# EAGLE design s3-pilot3 (EAGLE 7.5.0)
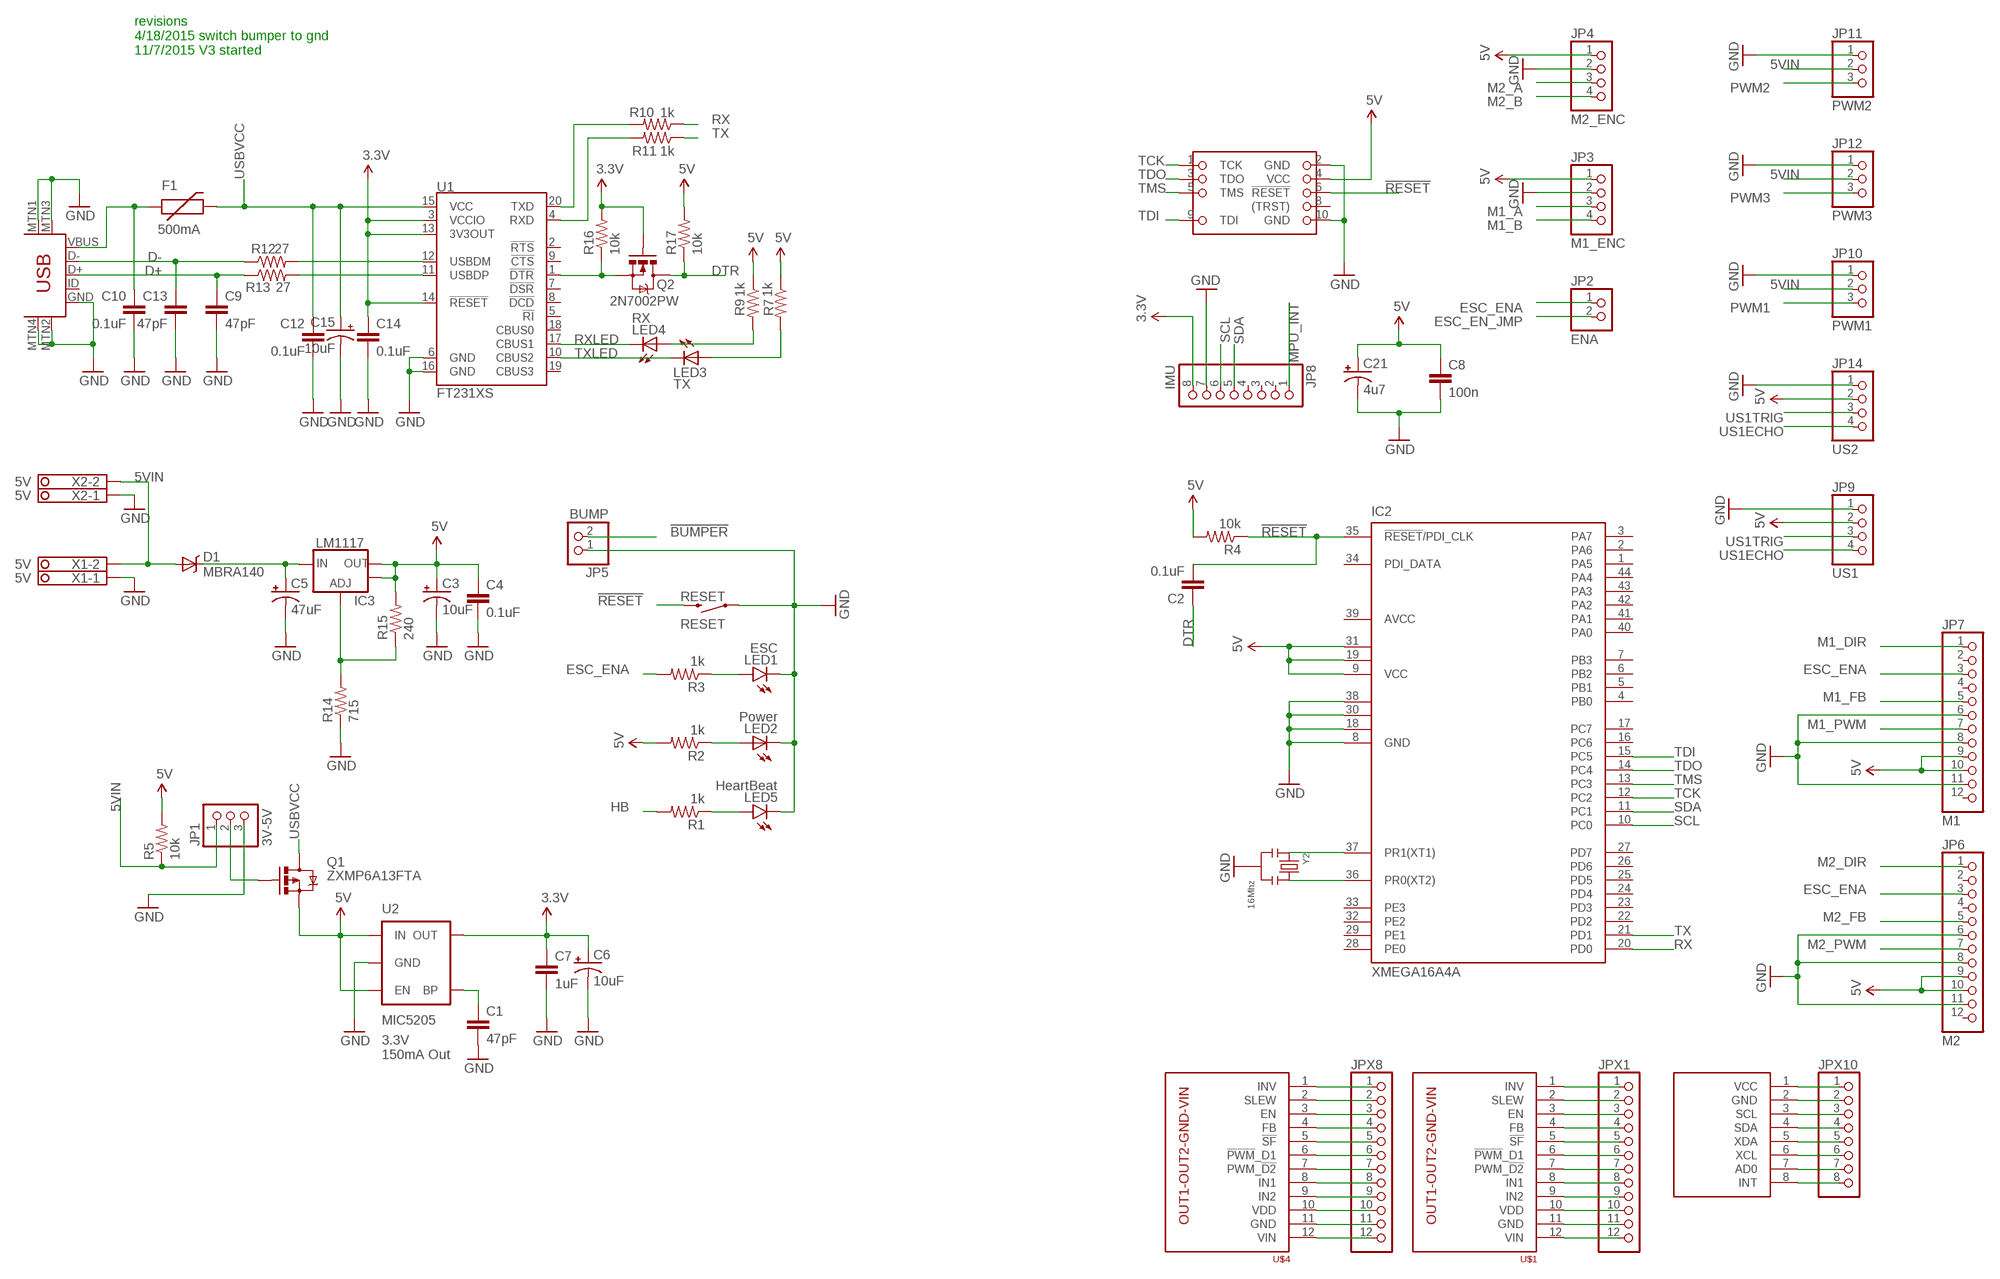
[diagram p0: schematic, sheet 1]

## Parts
C1  47pF  47PF-50V-5%(0603)  [0603-CAP]
C2  0.1uF  CAP0805  [0805]
C3  10uF  CAP_POL1206  [EIA3216]
C4  0.1uF  CAP0603-CAP  [0603-CAP]
C5  47uF  CAP_POLD  [PANASONIC_D]
C6  10uF  CAP_POL1206  [EIA3216]
C7  1uF  CAP0603-CAP  [0603-CAP]
C8  100n  CAP0603-CAP  [0603-CAP]
C9  47pF  47PF-50V-5%(0603)  [0603-CAP]
C10  0.1uF  CAP0603-CAP  [0603-CAP]
C12  0.1uF  CAP0603-CAP  [0603-CAP]
C13  47pF  47PF-50V-5%(0603)  [0603-CAP]
C14  0.1uF  CAP0603-CAP  [0603-CAP]
C15  10uF  CAP_POL1206  [EIA3216]
C21  4u7  CAP_POL1206  [EIA3216]
D1  MBRA140  DIODE-SCHOTTKY_  [SMA-DIODE]
F1  500mA  PTCSMD  [PTC-1206]
IC2  XMEGA16A4A  [TQFP44]
IC3  LM1117  V_REG_LM1117SOT223  [SOT223]
JP1  3V-5V  PINHD-1X3  [1X03]
JP2  ENA  PINHD-1X2  [1X02]
JP3  M1_ENC  PINHD-1X4/90  [1X04/90]
JP4  M2_ENC  PINHD-1X4/90  [1X04/90]
JP5  BUMP  PINHD-1X2/90  [1X02/90]
JP6  M2  PINHD-1X12  [1X12]
JP7  M1  PINHD-1X12  [1X12]
JP8  IMU  PINHD-1X8  [1X08]
JP9  US1  PINHD-1X4/90  [1X04/90]
JP10  PWM1  PINHD-1X3/90  [1X03/90]
JP11  PWM2  PINHD-1X3/90  [1X03/90]
JP12  PWM3  PINHD-1X3/90  [1X03/90]
JP14  US2  PINHD-1X4/90  [1X04/90]
JPX1  PINHD-1X12  [1X12]
JPX8  PINHD-1X12  [1X12]
JPX10  PINHD-1X8  [1X08]
LED1  ESC  LED-RED1206  [LED-1206]
LED2  Power  LED1206  [LED-1206]
LED3  TX  LED1206  [LED-1206]
LED4  RX  LED1206  [LED-1206]
LED5  HeartBeat  LED-RED1206  [LED-1206]
MPU6050  MPU-6050-BO  [MPU-6050-BO]
Q1  ZXMP6A13FTA  MOSFET-PCHANNELSMD  [SOT23-3]
Q2  2N7002PW  MOSFET-NCHANNEL2N7002PW  [SOT323]
R1  1k  RESISTOR0603-RES  [0603-RES]
R2  1k  RESISTOR0603-RES  [0603-RES]
R3  1k  RESISTOR0603-RES  [0603-RES]
R4  10k  RESISTOR0603-RES  [0603-RES]
R5  10k  RESISTOR0603-RES  [0603-RES]
R7  1k  RESISTOR0603-RES  [0603-RES]
R9  1k  RESISTOR0603-RES  [0603-RES]
R10  1k  RESISTOR0603-RES  [0603-RES]
R11  1k  RESISTOR0603-RES  [0603-RES]
R12  27  RESISTOR0603-RES  [0603-RES]
R13  27  RESISTOR0603-RES  [0603-RES]
R14  715  RESISTOR0603-RES  [0603-RES]
R15  240  RESISTOR0603-RES  [0603-RES]
R16  10k  RESISTOR0603-RES  [0603-RES]
R17  10k  RESISTOR0603-RES  [0603-RES]
RESET  RESET  SWITCH-MOMENTARY-2SMD-4  [TACTILE_SWITCH_TALL]
U1  FT231XS  [SSOP20_L]
U2  MIC5205  V_REG_LDOSMD  [SOT23-5]
U$1  M2  MC33926-SINGLE-BO  [MC33926-SINGLE-BO]
U$2  JTAG  CON-JTAG  [2X5/05]
U$4  M2  MC33926-SINGLE-BO  [MC33926-SINGLE-BO]
U$13  USB-MINIB-5PIN  [USB-MINIB]
X1  5V  1751248  [1751248]
X2  5V  1751248  [1751248]
Y2  16Mhz  SMD-RESONATOR-KYOCERA-PBRV-H  [SMD-KYOCERA-PBRV-H]

## Nets
3.3V: C6.A(+) C7.1 C14.1 JP8.8 Q2.1(G) R16.2 U1.3(VCCIO) U1.13(3V3OUT) U1.14(!RESET) U2.5(OUT)
5V [power]: C3.A(+) C4.1 C8.1 C21.A(+) IC2.9(VCC) IC2.19(VCC1) IC2.31(VCC2) IC3.2(OUT) IC3.4(OUT) JP3.1 JP4.1 JP6.9 JP6.10 JP7.9 JP7.10 JP9.2 JP14.2 Q1.2(S) R2.2 R4.2 R5.2 R7.1 R9.1 R15.2 R17.2 U2.1(IN) U2.3(EN) U$2.4(VCC)
5VIN [power]: D1.A JP1.1 JP10.2 JP11.2 JP12.2 R5.1 X1.2 X2.2
!BUMPER: JP5.2
!RESET: C2.2 IC2.35(!RESET!/PDI_CLK) R4.1 RESET.B2 U$2.6(!RESET)
D+: C9.1 R13.1 U$13.D+
D-: C13.1 R12.1 U$13.D-
DTR: C2.1 Q2.3(D) R17.1
ESC_EN_JMP: JP2.2
ESC_ENA: JP2.1 JP6.3 JP7.3 R3.2
GND [power]: C1.2 C3.C(-) C4.2 C5.- C6.C(-) C7.2 C8.2 C9.2 C10.2 C12.2 C13.2 C14.2 C15.C(-) C21.C(-) IC2.8(GND) IC2.18(GND1) IC2.30(GND2) IC2.38(GND3) JP1.3 JP3.2 JP4.2 JP5.1 JP6.6 JP6.8 JP6.11 JP7.6 JP7.8 JP7.11 JP8.7 JP9.1 JP10.1 JP11.1 JP12.1 JP14.1 LED1.C LED2.C LED5.C R14.1 RESET.A2 U1.6(GND) U1.16(GND) U2.2(GND) U$2.2(GND) U$2.10(GND) U$13.GND U$13.MTN1(MTN2) U$13.MTN2(MTN3) U$13.MTN3(MTN1) U$13.MTN4 X1.1 X2.1 Y2.2
HB: R1.2
M1_A: JP3.3
M1_B: JP3.4
M1_DIR: JP7.1
M1_FB: JP7.5
M1_PWM: JP7.7
M2_A: JP4.3
M2_B: JP4.4
M2_DIR: JP6.1
M2_FB: JP6.5
M2_PWM: JP6.7
MPU_INT: JP8.1
N$1: JPX8.1 U$4.1(INV)
N$2: LED2.A R2.1
N$3: JPX8.2 U$4.2(SLEW)
N$4: JPX8.3 U$4.3(EN)
N$6: R12.2 U1.12(USBDM)
N$7: R13.2 U1.11(USBDP)
N$8: LED3.A R7.2
N$10: LED4.A R9.2
N$11: C1.1 U2.4(BP)
N$12: Q2.2(S) R16.1 U1.1(!DTR)
N$13: JPX10.1 MPU6050.1(VCC)
N$14: JPX10.2 MPU6050.2(GND)
N$15: IC3.1(ADJ) R14.2 R15.1
N$16: JPX10.3 MPU6050.3(SCL)
N$17: JPX10.4 MPU6050.4(SDA)
N$18: JPX1.1 U$1.1(INV)
N$19: JPX10.5 MPU6050.5(XDA)
N$20: JPX10.6 MPU6050.6(XCL)
N$21: LED5.A R1.1
N$22: JPX10.7 MPU6050.7(AD0)
N$23: LED1.A R3.1
N$24: JP1.2 Q1.1(G)
N$25: JPX1.2 U$1.2(SLEW)
N$26: JPX10.8 MPU6050.8(INT)
N$27: JPX8.4 U$4.4(FB)
N$28: JPX8.5 U$4.5(!SF)
N$29: JPX8.6 U$4.6(!PWM!_D1)
N$30: JPX8.7 U$4.7(PWM_!D2)
N$31: JPX8.8 U$4.8(IN1)
N$32: JPX8.9 U$4.9(IN2)
N$33: JPX8.10 U$4.10(VDD)
N$34: JPX8.11 U$4.11(GND)
N$35: JPX8.12 U$4.12(VIN)
N$36: IC2.36(PR0(XT2)) Y2.3
N$37: JPX1.3 U$1.3(EN)
N$38: JPX1.4 U$1.4(FB)
N$39: JPX1.5 U$1.5(!SF)
N$40: IC2.37(PR1(XT1)) Y2.1
N$41: JPX1.6 U$1.6(!PWM!_D1)
N$42: JPX1.7 U$1.7(PWM_!D2)
N$43: JPX1.8 U$1.8(IN1)
N$44: JPX1.9 U$1.9(IN2)
N$45: JPX1.10 U$1.10(VDD)
N$46: JPX1.11 U$1.11(GND)
N$47: JPX1.12 U$1.12(VIN)
PISUPPLY: C5.+ D1.C IC3.3(IN)
PWM1: JP10.3
PWM2: JP11.3
PWM3: JP12.3
RX: IC2.20(PD0) R10.1
RXD: R11.2 U1.4(RXD)
RXLED: LED4.C U1.17(CBUS1)
SCL: IC2.10(PC0) JP8.6
SDA: IC2.11(PC1) JP8.5
TCK: IC2.12(PC2) U$2.1(TCK)
TDI: IC2.15(PC5) U$2.9(TDI)
TDO: IC2.14(PC4) U$2.3(TDO)
TMS: IC2.13(PC3) U$2.5(TMS)
TX: IC2.21(PD1) R11.1
TXD: R10.2 U1.20(TXD)
TXLED: LED3.C U1.10(CBUS2)
US1ECHO: JP9.4 JP14.4
US1TRIG: JP9.3 JP14.3
USBVCC [power]: C12.1 C15.A(+) F1.2 Q1.3(D) U1.15(VCC)
VUSB [power]: C10.1 F1.1 U$13.VBUS
Unconnected: IC2.1(PA5) IC2.2(PA6) IC2.3(PA7) IC2.4(PB0) IC2.5(PB1) IC2.6(PB2) IC2.7(PB3) IC2.16(PC6) IC2.17(PC7) IC2.22(PD2) IC2.23(PD3) IC2.24(PD4) IC2.25(PD5) IC2.26(PD6) IC2.27(PD7) IC2.28(PE0) IC2.29(PE1) IC2.32(PE2) IC2.33(PE3) IC2.34(PDI_DATA) IC2.40(PA0) IC2.41(PA1) IC2.42(PA2) IC2.43(PA3) IC2.44(PA4) JP6.2 JP6.4 JP6.12 JP7.2 JP7.4 JP7.12 JP8.2 JP8.3 JP8.4 U1.2(!RTS) U1.5(!RI) U1.7(!DSR) U1.8(!DCD) U1.9(!CTS) U1.18(CBUS0) U1.19(CBUS3) U$2.8((TRST)) U$13.ID

## Notes on the sheet
- revisions
  4/18/2015 switch bumper to gnd
  11/7/2015 V3 started
- 3.3V
  150mA Out

## Power pins joined to a net without a drawn wire
AVCC: IC2.39(AVCC)

## Library data of the parts
C1 C9 C13 = SparkFun-Capacitors:47PF-50V-5%(0603): CAP-08913; PROD_ID: CAP-08913
C2 C4 C7 C8 C10 C12 C14 = SparkFun:CAP: Capacitor Standard 0603 ceramic capacitor, and 0.1" leaded capacitor.
C3 C5 C6 C21 = SparkFun:CAP_POL: Capacitor Polarized These are standard SMD and PTH capacitors. Normally 10uF, 47uF, and 100uF in electrolytic and tantalum varieties. Always verify the external diameter of the through hole cap, it varies with capacity, voltage, and manufacturer. The EIA devices should be standard.
C15 = SparkFun-Capacitors:CAP_POL: Capacitor Polarized These are standard SMD and PTH capacitors. Normally 10uF, 47uF, and 100uF in electrolytic and tantalum varieties. Always verify the external diameter of the through hole cap, it varies with capacity, voltage, and manufacturer. The EIA devices should be standard.
D1 = SparkFun:DIODE-SCHOTTKY
F1 = SparkFun:PTC: Resettable Fuse PTC Resettable Fuse. Spark Fun Electronics SKU : COM-08357
IC2 = atmel:XMEGA16A4: MICROCONTROLLER Features High-performance, Low-power 8/16-bit AVR XMEGA Microcontroller Non-Volatile Program and Data Memories - 16 KB - 128 KB of In-System Self-Programmable Flash - 4 KB - 8 KB Boot Code Section with Independent Lock Bits - 1 KB - 2 KB EEPROM - 2 KB - 8 KB Internal SRAM Peripheral Features - Four-channel DMA Controller with support for external requests - Eight-channel Event System - Five 16-bit Timer/Counters Three Timer/Counters with 4 Output Compare or Input Capture channels Two Timer/Counters with 2 Output Compare or Input Capture channels High-Resolution Extensions on all Timer/Counters Advanced Waveform Extension on one Timer/Counter - Five USARTs IrDA Extension on one USART - Two Two-Wire Interfaces with dual address match (I2C and SMBus compatible) - Two SPIs (Serial Peripheral Interfaces) peripherals - AES and DES Crypto Engine - 16-bit Real Time Counter with Separate Oscillator - One Twelve-channel, 12-bit, 2 Msps Analog to Digital Converter - One Two-channel, 12-bit, 1 Msps Digital to Analog Converter - Two Analog Comparators with Window compare function - External Interrupts on all General Purpose I/O pins - Programmable Watchdog Timer with Separate On-chip Ultra Low Power Oscillator Special Microcontroller Features - Power-on Reset and Programmable Brown-out Detection - Internal and External Clock Options with PLL - Programmable Multi-level Interrupt Controller - Sleep Modes: Idle, Power-down, Standby, Power-save, Extended Standby - Advanced Programming, Test and Debugging Interfaces PDI (Program and Debug Interface) for programming, test and debugging I/O and Packages - 34 Programmable I/O Lines - 44 - lead TQFP - 44 - pad VQFN/QFN - 49 - ball VFBGA Operating Voltage - 1.6 - 3.6V Speed performance - 0 - 12 MHz @ 1.6 - 3.6V - 0 - 32 MHz @ 2.7 - 3.6V Drawn by Dipl.-Ing. (FH) Robert Siegler Created: 27.05.09; OC_FARNELL: unknown; OC_NEWARK: unknown
IC3 = Testing:V_REG_LM1117: Voltage Regulator LM1117 Standard adjustable voltage regulator but in SMD form. Spark Fun Electronics SKU : COM-00595
JP1 JP10-JP12 = pinhead:PINHD-1X3: PIN HEADER
JP2 JP5 = pinhead:PINHD-1X2: PIN HEADER
JP3 JP4 JP9 JP14 = pinhead:PINHD-1X4: PIN HEADER
JP6 JP7 JPX1 JPX8 = pinhead:PINHD-1X12: PIN HEADER
JP8 JPX10 = pinhead:PINHD-1X8: PIN HEADER
LED1 LED5 = SparkFun-LED:LED-RED: Assorted Red LEDs LilyPad 1206- DIO-09912 1206- DIO-00809 0603- DIO-00819; PROD_ID: DIO-00809; VALUE: RED
LED2-LED4 = SparkFun-LED:LED: LEDs Standard schematic elements and footprints for 5mm, 3mm, 1206, and 0603 sized LEDs. 5mm - Spark Fun Electronics SKU : COM-00529 (and others)
MPU6050 = s3-pilot2-lbr:MPU-6050-BO
Q1 = SparkFun:MOSFET-PCHANNEL
Q2 = SparkFun-DiscreteSemi:MOSFET-NCHANNEL: Common NMOSFET Parts MFG P/N Store ID Prod ID FDD8780 TRANS-09984 SI7820DN TRANS-11055 FDS6630A IC-08089 2N7002PW TRANS-11151 FQP30N06L COM-10213 TRANS-10060 BSS123LT1G TRANS-08345 BSS138 TRANS-00830 BS170 2N7000; PROD_ID: TRANS-11151
R1-R5 R7 R9-R11 R14-R17 = SparkFun:RESISTOR: Resistor Basic schematic elements and footprints for 0603, 1206, and PTH resistors.
R12 R13 = SparkFun-Resistors:RESISTOR: Resistor Basic schematic elements and footprints for 0603, 1206, and PTH resistors.
RESET = SparkFun-Electromechanical:SWITCH-MOMENTARY-2: Various NO switches- pushbuttons, reed, etc; PROD_ID: SWCH-11966
U1 = SparkFun-DigitalIC:FT231X: FTDI FT231X Full Speed USB to Full-handshake UART This USB2.0 Full Speed IC offers a compact bridge to full handshake UART interfaces. The device is a UART, capable of operating up to 3MBaud, with low power consumption (8mA). The FT231X includes the complete FT-X series feature set and enables USB to be added into a system design quickly and easily over a UART interface.
U2 = SparkFun:V_REG_LDO: Voltage Regulator LDO Standard 150mA LDO voltage regulator in SOT-23 layout. Micrel part MIC5205. BP (by-pass) pin is used to lower output noise with 470pF cap.
U$1 U$4 = s3-pilot2-lbr:MC33926-SINGLE-BO
U$2 = s3-pilot2-lbr:CON-JTAG
U$13 = SparkFun-Connectors:USB-MINIB: Mini-USB "B" connector with 5th pin broken out. Created new symbol breaking out 5th "ID" pin in mini/micro USB connector spec. See: http://en.wikipedia.org/wiki/Mini_usb#Cables. Uses same footprint as 4-pin symbol. Also added pins to connect to mounting / shield pads if required (probably not generally needed as signals aren't shielded once they leave the connector).
X1 X2 = con-phoenix-350:1751248: MKDS 1/ 2-3,5 Printklemme Nennstrom: 10 A Bemessungsspannung: 160 V Raster: 3,5 mm Polzahl: 2 Montageart: Löten Anschlussart: Schraubanschluss Anschlussrichtung vom Leiter zur Platine: 0° Source: http://eshop.phoenixcontact.com .. 1751248.pdf; OC_FARNELL: unknown; OC_NEWARK: unknown
Y2 = s3-pilot2-lbr:SMD-RESONATOR-KYOCERA-PBRV-H: kyocera PBRC14.74HR50X000; OPTION: Crystal or ceramic resonator. Max 12MHz for 3V3 operation.

## Net classes
1 power: width 0.381 mm

## Board
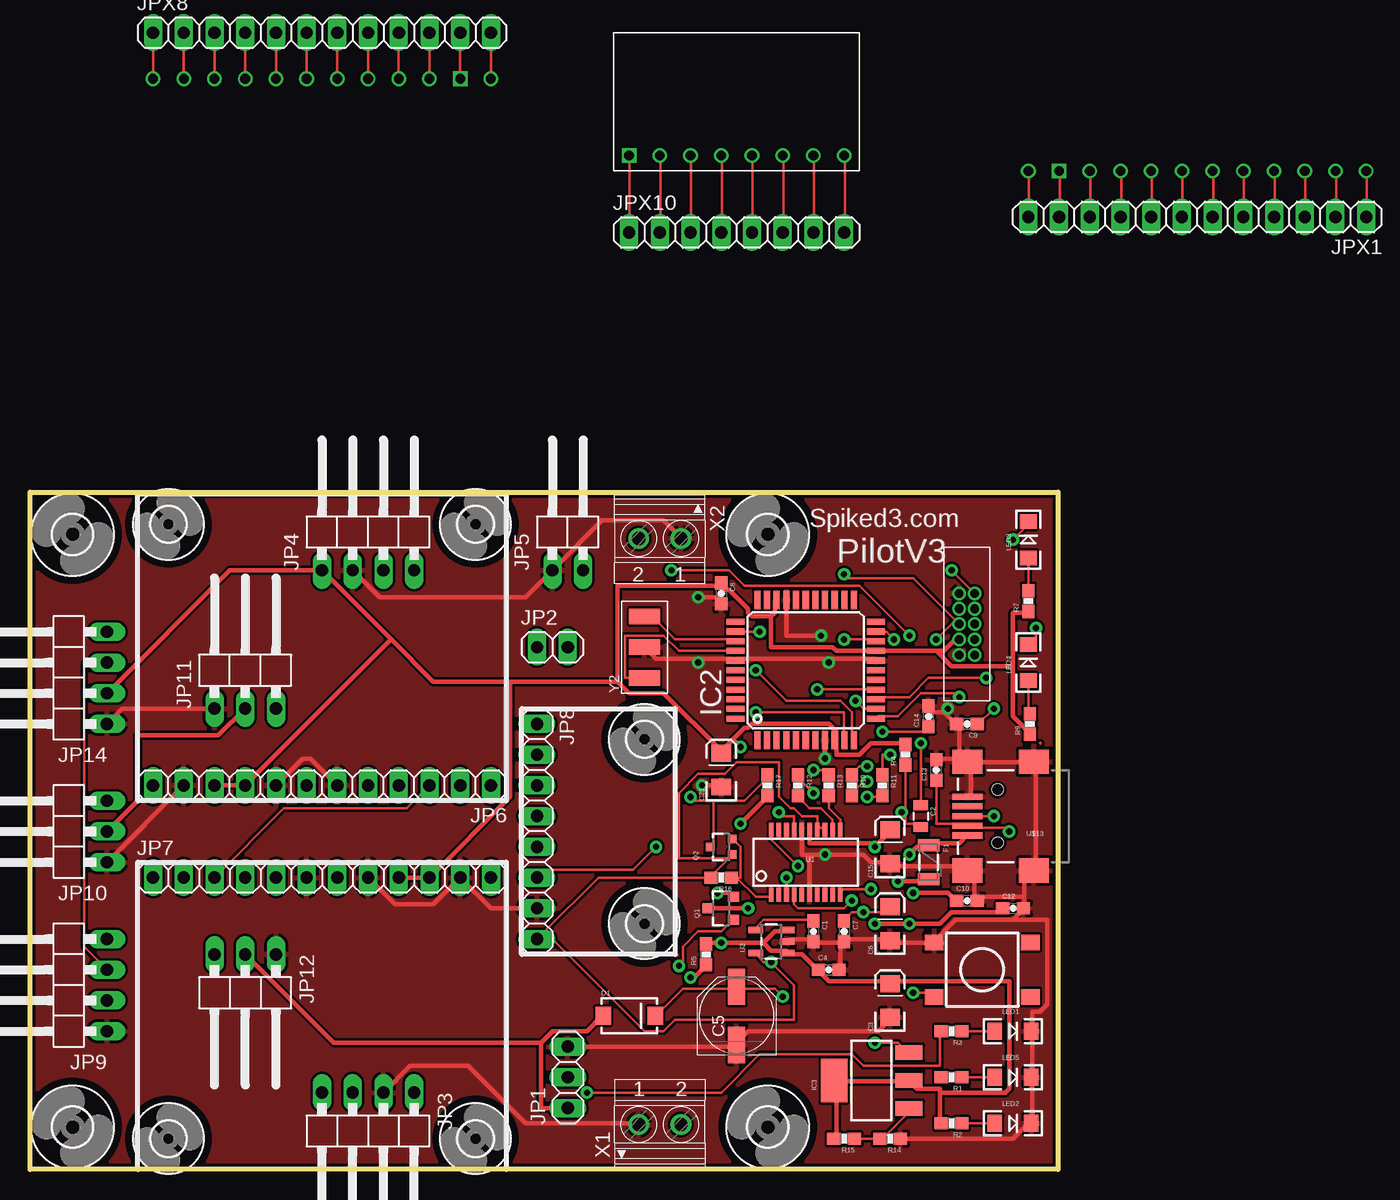
[diagram p1: board, top side]
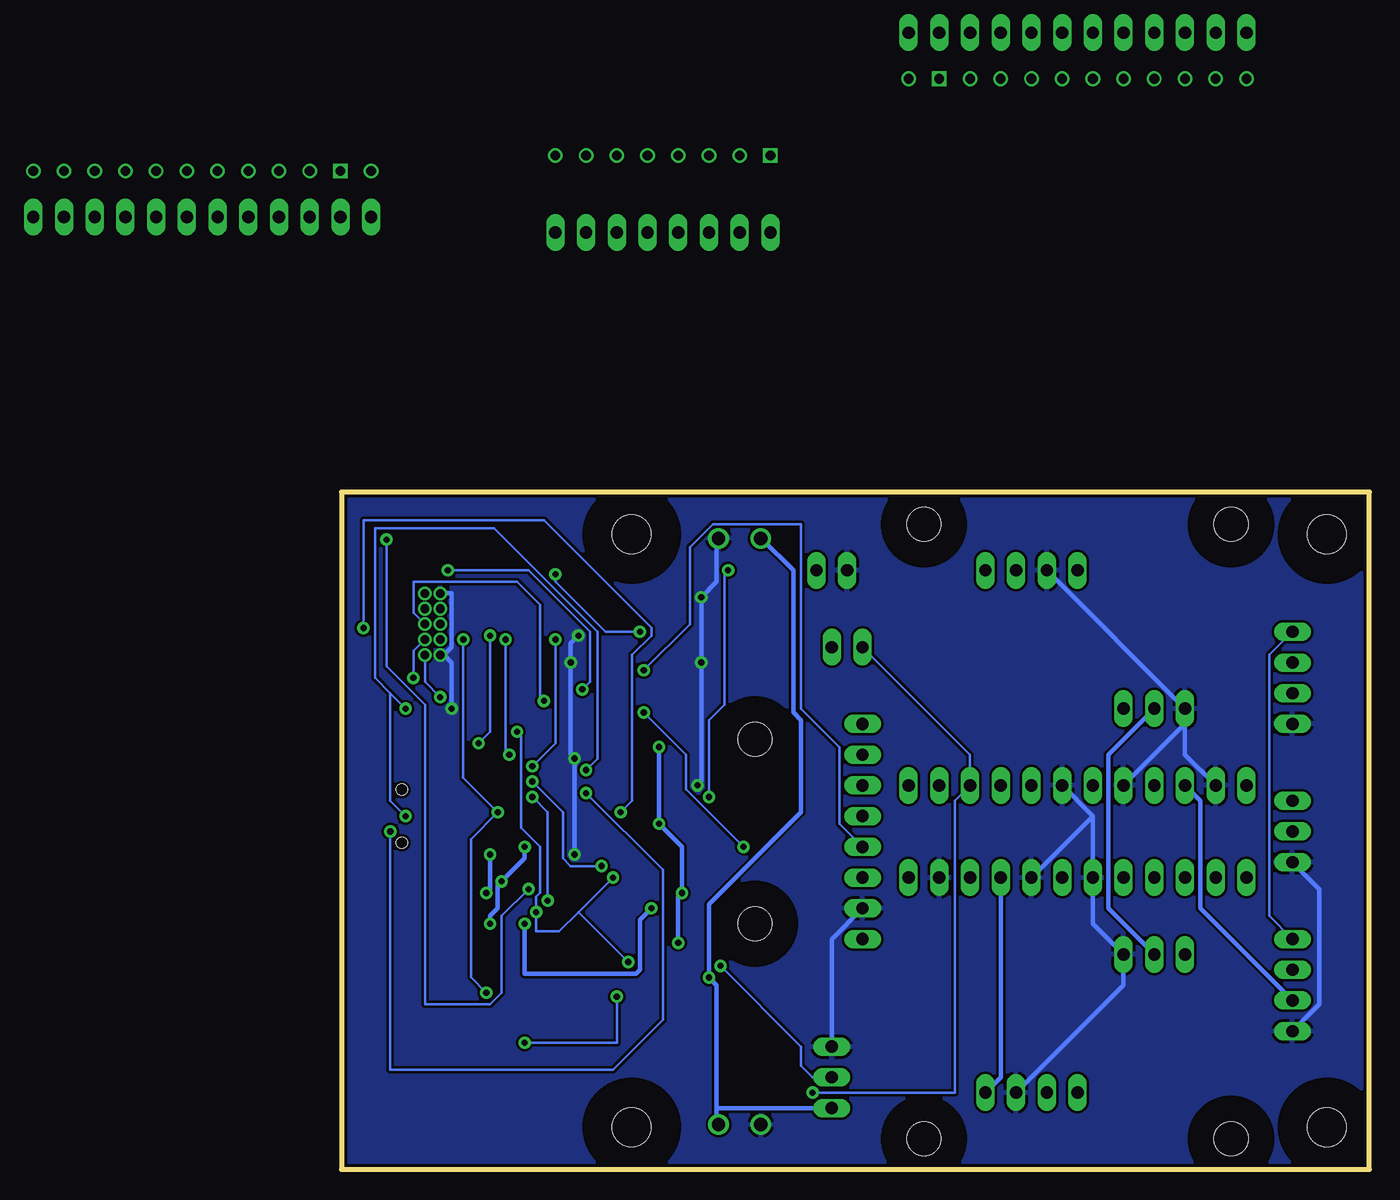
[diagram p2: board, bottom side, seen from below]

Size 85 x 56 mm. Coordinates in mm from the lower left corner, seen from the top.
Outline: 85,0 0,0 0,56 85,56 85,0
Copper layers (1*16): Top 0.035mm / dielectric 1.5mm / Bottom 0.035mm
Design rules "SparkFun *": minimum track width 8mil, minimum drill 20mil, track to track 8mil, track to pad 8mil, pad to pad 8mil, via to via 8mil, smd to smd 8mil, copper to edge 10mil, drill to drill 8mil, minimum pad ring 8mil, minimum via ring 10mil, stop-mask expansion 4mil, vias tented up to drill 25mil, thermal gap 10mil

### Footprints (pad centres in the part's own frame; a part is rotated, then mirrored left to right if it is on the bottom)
0603-CAP = smd 1.1 x 1: 1 -0.85,0; 2 0.85,0
0805 = smd 0.8 x 1.2: 1 -0.9,0; 2 0.9,0
EIA3216 = smd 1.4 x 1.6: A 1.4,0; C -1.4,0
PANASONIC_D = smd 3 x 1.4: + 2.4,0; - -2.4,0
SMA-DIODE = smd 1.27 x 1.47: A -2.15,0; C 2.15,0
2,8 = hole 2.8: 0,0
3,2 = hole 3.2: 0,0
PTC-1206 = smd 1 x 1.8: 1 -1.4,0; 2 1.4,0
TQFP44 = smd 1.5 x 0.5: 1 -5.8,4; 2 -5.8,3.2; 3 -5.8,2.4; 4 -5.8,1.6; 5 -5.8,0.8; 6 -5.8,0; 7 -5.8,-0.8; 8 -5.8,-1.6; 9 -5.8,-2.4; 10 -5.8,-3.2; 11 -5.8,-4; 23 5.8,-4; 24 5.8,-3.2; 25 5.8,-2.4; 26 5.8,-1.6; 27 5.8,-0.8; 28 5.8,0; 29 5.8,0.8; 30 5.8,1.6; 31 5.8,2.4; 32 5.8,3.2; 33 5.8,4 | smd 0.5 x 1.5: 12 -4,-5.8; 13 -3.2,-5.8; 14 -2.4,-5.8; 15 -1.6,-5.8; 16 -0.8,-5.8; 17 0,-5.8; 18 0.8,-5.8; 19 1.6,-5.8; 20 2.4,-5.8; 21 3.2,-5.8; 22 4,-5.8; 34 4,5.8; 35 3.2,5.8; 36 2.4,5.8; 37 1.6,5.8; 38 0.8,5.8; 39 0,5.8; 40 -0.8,5.8; 41 -1.6,5.8; 42 -2.4,5.8; 43 -3.2,5.8; 44 -4,5.8
SOT223 = smd 1.219 x 2.235: 1 -2.311,-3.099; 2 0,-3.099; 3 2.311,-3.099 | smd 3.6 x 2.2: 4 0,3.099
1X03 = drill 1.016 long: 1 -2.54,0; 2 0,0; 3 2.54,0
1X02 = drill 1.016 long: 1 -1.27,0; 2 1.27,0
1X04/90 = drill 1.016 long: 1 -3.81,-3.81; 2 -1.27,-3.81; 3 1.27,-3.81; 4 3.81,-3.81
1X02/90 = drill 1.016 long: 1 -1.27,-3.81; 2 1.27,-3.81
1X12 = drill 1.016 long: 1 -13.97,0; 2 -11.43,0; 3 -8.89,0; 4 -6.35,0; 5 -3.81,0; 6 -1.27,0; 7 1.27,0; 8 3.81,0; 9 6.35,0; 10 8.89,0; 11 11.43,0; 12 13.97,0
1X08 = drill 1.016 long: 1 -8.89,0; 2 -6.35,0; 3 -3.81,0; 4 -1.27,0; 5 1.27,0; 6 3.81,0; 7 6.35,0; 8 8.89,0
1X03/90 = drill 1.016 long: 1 -2.54,-3.81; 2 0,-3.81; 3 2.54,-3.81
LED-1206 = smd 1.2 x 1.4: A -1.5,0; C 1.5,0
MPU-6050-BO = drill 0.8 square: 1 1.27,19.05 | drill 0.8: 2 1.27,16.51; 3 1.27,13.97; 4 1.27,11.43; 5 1.27,8.89; 6 1.27,6.35; 7 1.27,3.81; 8 1.27,1.27
SOT23-3 = smd 0.8 x 0.9: 1 -0.95,-1; 2 0.95,-1; 3 0,1.1
SOT323 = smd 0.7 x 0.7: 1 -0.65,-0.925; 2 0.65,-0.925; 3 0,0.925
0603-RES = smd 1.1 x 1: 1 -0.85,0; 2 0.85,0
TACTILE_SWITCH_TALL = smd 1.55 x 1.3: A1 -3.975,-2.25; A2 3.975,-2.25; B1 -3.975,2.25; B2 3.975,2.25
SSOP20_L = smd 0.381 x 1.143: 1 -2.857,-2.68; 2 -2.223,-2.68; 3 -1.587,-2.68; 4 -0.953,-2.68; 5 -0.318,-2.68; 6 0.318,-2.68; 7 0.953,-2.68; 8 1.587,-2.68; 9 2.223,-2.68; 10 2.857,-2.68; 11 2.857,2.68; 12 2.223,2.68; 13 1.587,2.68; 14 0.953,2.68; 15 0.318,2.68; 16 -0.318,2.68; 17 -0.953,2.68; 18 -1.587,2.68; 19 -2.223,2.68; 20 -2.857,2.68
SOT23-5 = smd 0.55 x 1.2: 1 -0.95,-1.3; 2 0,-1.3; 3 0.95,-1.3; 4 0.95,1.3; 5 -0.95,1.3
MC33926-SINGLE-BO = drill 0.8: 1 -5.08,-21.59; 2 -5.08,-19.05; 3 -5.08,-16.51; 4 -5.08,-13.97; 5 -5.08,-11.43; 6 -5.08,-8.89; 7 -5.08,-6.35; 8 -5.08,-3.81; 9 -5.08,-1.27; 10 -5.08,1.27; 12 -5.08,6.35 | drill 0.8 square: 11 -5.08,3.81
2X5/05 = drill 0.711: 1 -0.635,3.175; 2 0.635,3.175; 3 -0.635,1.905; 4 0.635,1.905; 5 -0.635,0.635; 6 0.635,0.635; 7 -0.635,-0.635; 8 0.635,-0.635 | drill 0.7: 9 -0.635,-1.905; 10 0.635,-1.905
USB-MINIB = smd 2.5 x 0.5: D+ 2.5,0; D- 2.5,0.8; GND 2.5,-1.6; ID 2.5,-0.8; VBUS 2.5,1.6 | smd 2.5 x 2: MTN1 -3,4.5; MTN2 2.5,4.5; MTN3 -3,-4.5; MTN4 2.5,-4.5 | hole 0.9: 0,2.2; 0,-2.2
1751248 = drill 1.1 pad 1.7: 1 -1.75,-0.1; 2 1.75,-0.1
SMD-KYOCERA-PBRV-H = smd 1.27 x 2.54: 1 -2.54,0; 2 0,0; 3 2.54,0

### Placement (x,y rotation side)
C1  64.77,19.68 270 top
C2  73.66,29.21 270 top
C3  71.12,13.97 90 top
C4  66.04,16.51 0 top
C5  58.42,12.7 90 top
C6  71.12,20.32 90 top
C7  67.31,19.68 270 top
C8  57.15,47.62 270 top
C9  77.47,36.83 180 top
C10  77.47,22.23 0 top
C12  81.28,21.59 0 top
C13  74.93,33.02 90 top
C14  74.3,37.47 90 top
C15  71.12,26.67 90 top
C21  57.15,33.02 90 top
D1  49.53,12.7 0 top
E$1  [2,8]  50.8,20.32 0 top
E$2  [3,2]  3.5,3.5 90 top
E$3  [3,2]  3.5,52.5 90 top
E$4  [2,8]  50.8,35.56 0 top
E$5  [3,2]  61,3.5 90 top
E$6  [3,2]  61,52.5 90 top
E$12  [2,8]  11.43,53.34 0 top
E$15  [2,8]  36.83,53.34 0 top
E$16  [2,8]  11.43,2.54 0 top
E$17  [2,8]  36.83,2.54 0 top
F1  74.3,25.4 270 top
IC2  64.14,41.27 90 top
IC3  69.58,7.35 90 top
JP1  44.45,7.62 90 top
JP2  43.18,43.18 0 top
JP3  27.94,2.54 180 top
JP4  27.94,53.34 0 top
JP5  44.45,53.34 0 top
JP6  24.13,31.75 180 top
JP7  24.13,24.13 0 top
JP8  41.91,27.94 270 top
JP9  2.54,15.24 90 top
JP10  2.54,27.94 90 top
JP11  17.78,41.91 0 top
JP12  17.78,13.97 180 top
JP14  2.54,40.64 90 top
JPX1  96.52,78.74 180 top  (outside the outline)
JPX8  24.13,93.98 0 top  (outside the outline)
JPX10  58.42,77.47 0 top  (outside the outline)
LED1  81.28,11.43 0 top
LED2  81.28,3.81 0 top
LED3  82.55,52.07 90 top
LED4  82.55,41.91 90 top
LED5  81.28,7.62 0 top
MPU6050  68.58,82.55 90 top  (outside the outline)
Q1  57.15,21.59 90 top
Q2  57.15,26.67 90 top
R1  76.2,7.62 180 top
R2  76.2,3.81 180 top
R3  76.2,11.43 180 top
R4  72.39,34.29 90 top
R5  55.88,17.78 90 top
R7  82.55,46.99 90 top
R9  82.68,36.83 90 top
R10  67.94,31.75 270 top
R11  70.48,31.75 270 top
R12  63.5,31.75 270 top
R13  66.04,31.75 270 top
R14  71.12,2.54 180 top
R15  67.31,2.54 180 top
R16  57.15,24.13 180 top
R17  60.96,31.75 270 top
RESET  78.74,16.51 180 top
U1  64.14,25.4 0 top
U2  61.3,18.84 90 top
U$1  88.9,87.63 90 top  (outside the outline)
U$2  77.47,45.72 180 top
U$4  31.75,85.09 270 top  (outside the outline)
U$13  80.01,29.21 180 top
X1  52.07,3.81 0 top
X2  52.07,52.07 180 top
Y2  50.8,43.18 90 top

### Tracks (layer width: path | path; a pad name or v marks a point on that pad's centre or on a via)
3.3V  (via drill 0.51)
  Top 0.203: C7.1 67.31,20.64 67.94,21.27 v68.9,21.27 70.8,21.27 71.12,21.59 C6.A | v70.48,36.2 73.98,36.2 74.3,36.51 C14.1 | v62.55,24.13 U1.3 | U2.5 60.01,17.78 60.64,17.14 v61.28,17.14 63.18,15.24 63.18,12.38 53.34,12.38 52.39,11.43 50.8,11.43 42.55,19.68 | 65.09,28.26 65.72,28.26 U1.13 | 56.2,24.13 57.78,25.72 | 65.09,28.26 65.09,29.21 63.82,29.21 63.18,29.84 62.87,29.84 61.91,30.8 61.91,33.66 58.42,33.66 57.47,32.7 55.24,32.7 53.66,31.11 53.66,25.72 57.78,25.72 | 65.09,28.26 U1.14 | 57.78,25.72 Q2.1 | 42.55,19.68 46.99,24.13 56.2,24.13 | 56.2,24.13 R16.2 | 42.55,19.68 JP8.8
  Bottom 0.203: v70.48,36.2 70.17,35.88 70.17,28.26 68.58,26.67 68.58,22.86 68.9,22.54 v68.9,21.27 68.9,19.68 66.99,19.68 65.41,21.27 | 65.41,21.27 v62.55,24.13 | 65.41,21.27 v61.28,17.14
5V  (via drill 0.51)
  Top 0.381: 75.25,6.35 75.25,6.67 73.34,6.67 72.71,7.3 IC3.2 72.39,7.3 66.67,7.3 | 75.25,6.35 75.25,3.81 R2.2 | 66.67,7.3 66.67,2.54 R15.2 | 66.67,7.3 IC3.4 | 65.09,16.51 63.82,17.78 62.87,17.78 U2.1 62.55,18.1 61.28,18.1 60.64,18.73 | 71.12,15.56 66.04,15.56 65.09,16.51 | 65.09,16.51 C4.1 | v56.83,22.86 57.78,22.86 58.1,22.54 Q1.2 | R5.2 55.88,18.73 v57.15,18.73 60.64,18.73 | v58.74,28.57 60.96,30.8 R17.2 | 60.64,18.73 61.59,19.68 62.55,19.68 U2.3 | 75.25,6.35 80.64,6.35 80.96,6.67 80.96,15.56 71.12,15.56 | 71.12,15.56 C3.A | JP6.10 JP6.9 29.84,43.81 | JP14.2 16.51,49.53 JP4.1 29.84,43.81 | JP7.9 JP7.10 39.69,30.8 39.69,40.32 | R4.2 72.39,35.24 69.53,35.24 68.58,34.29 66.67,34.29 66.67,35.24 IC2.9 66.67,35.56 66.67,36.2 66.04,36.83 59.69,36.83 59.37,36.51 59.05,36.51 58.1,35.56 | 58.1,35.56 57.15,34.61 | 81.28,41.59 81.28,46.04 82.55,46.04 R7.1 | 81.28,41.59 81.28,37.47 82.55,36.2 R9.1 | 57.15,48.26 57.47,47.94 57.78,47.94 59.37,46.35 59.37,46.04 59.69,45.72 61.28,45.72 | 61.28,45.72 61.59,46.04 61.59,46.99 IC2.31 | 74.93,42.86 75.56,42.86 76.52,43.81 U$2.4 | 74.93,42.86 70.17,42.86 IC2.19 69.85,42.86 66.67,42.86 66.36,43.18 61.28,43.18 61.28,45.72 | 81.28,41.59 76.2,41.59 74.93,42.86 | 57.15,34.61 52.39,39.37 49.53,39.37 48.58,40.32 | 48.58,40.32 48.58,48.26 57.15,48.26 | 57.15,34.61 C21.A | 57.15,48.26 C8.1 | 48.58,40.32 39.69,40.32 | 29.84,43.81 33.34,40.32 39.69,40.32 | 58.1,35.56 v58.74,34.92
  Bottom 0.381: v57.15,18.73 57.15,22.54 v56.83,22.86 56.83,26.67 v58.74,28.57 v58.74,34.92 | JP9.2 13.97,21.59 13.97,30.48 JP6.10 | JP3.1 30.48,7.62 JP7.9
5VIN  (via drill 0.51)
  Top 0.381: JP10.2 8.89,30.48 8.89,35.88 15.56,35.88 JP11.2 | 42.23,10.48 43.18,11.43 46.04,11.43 47.31,12.7 D1.A | 42.23,10.48 42.23,5.08 JP1.1 | v54.61,15.88 54.93,15.88 55.88,16.83 R5.1 | JP12.2 25.08,10.48 42.23,10.48
  Bottom 0.381: JP12.2 21.59,21.59 21.59,34.29 JP11.2 | 53.98,5.08 53.98,3.81 X1.2 | 53.98,5.08 53.98,15.24 v54.61,15.88 54.61,21.91 46.99,29.53 46.99,37.15 47.62,37.78 47.62,49.53 50.16,52.07 X2.2 | 53.98,5.08 JP1.1
!RESET  (via drill 0.51)
  Top 0.203: 72.39,29.53 72.39,28.57 73.66,28.57 C2.2 | 72.39,29.53 R4.1 | v73.03,14.61 74.3,14.61 74.61,14.29 RESET.B2 | 72.39,29.53 v72.07,29.53 | v60.33,44.45 58.42,44.45 IC2.35 | v67.31,49.21 67.63,48.9 73.03,48.9 76.52,45.4 | 76.52,45.4 v74.93,43.81 | 76.52,45.4 U$2.6
  Bottom 0.203: v73.03,14.61 74.3,15.88 74.3,27.3 v72.07,29.53 74.93,32.38 v74.93,43.81 | v60.33,44.45 63.18,44.45 67.31,48.58 v67.31,49.21
D+  (via drill 0.51)
  Top 0.203: v64.77,33.02 65.72,33.02 66.04,32.7 R13.1 | v79.69,38.1 78.42,36.83 C9.1 | v79.69,29.21 U$13.D+
  Bottom 0.203: v64.77,33.02 63.82,33.97 63.82,44.45 72.39,53.02 82.23,53.02 82.23,40.64 80.96,39.37 | v79.69,38.1 80.96,39.37 | v79.69,29.21 80.96,30.48 80.96,39.37
D-  (via drill 0.51)
  Top 0.203: C13.1 74.93,28.57 77.47,28.57 U$13.D- 77.79,28.26 80.64,28.26 v80.96,27.94 | v64.77,31.11 63.5,32.38 R12.1
  Bottom 0.203: v64.77,31.11 58.42,24.77 58.42,12.38 62.55,8.26 80.96,8.26 v80.96,27.94
DTR  (via drill 0.51)
  Top 0.203: 56.52,30.48 56.52,26.67 Q2.3 | 56.52,30.48 59.05,30.48 60.96,32.38 R17.1 | v73.66,35.24 C2.1 | v72.71,44.13 68.58,48.26 59.05,48.26 57.78,49.53 v53.02,49.53 | v54.61,30.8 54.93,30.48 56.52,30.48
  Bottom 0.203: v73.66,35.24 72.71,36.2 v72.71,44.13 | v53.02,49.53 53.34,49.21 53.34,38.42 54.61,37.15 v54.61,30.8
ESC_ENA  (via drill 0.51)
  Top 0.203: v46.04,6.35 57.15,6.35 60.33,9.53 67.94,9.53 68.9,8.57 75.25,8.57 75.25,11.43 R3.2 | JP7.3 20.95,29.84 31.11,29.84 JP6.3
  Bottom 0.203: v46.04,6.35 34.29,6.35 34.29,30.48 JP6.3 33.02,34.29 JP2.1
GND  (via drill 0.51)
  Top 0.381: JP8.7 38.1,21.59 JP7.11 33.34,21.91 30.16,21.91 JP7.8 | C3.C 71.12,12.38 70.17,11.43 59.37,11.43 58.42,10.48 C5.- 58.42,10.16 JP1.3 | JP3.2 31.43,8.57 36.2,8.57 40.96,3.81 50.16,3.81 X1.1 | 75.56,37.78 74.61,37.78 74.3,38.1 C14.2 | 75.56,37.78 76.52,36.83 C9.2 76.83,36.83 76.83,33.97 | 76.83,33.97 77.47,33.97 U$13.MTN4 | 76.83,33.97 74.93,33.97 C13.2 | 76.83,33.97 U$13.MTN4 | 77.79,33.66 77.79,30.8 U$13.GND | 77.79,33.66 82.87,33.66 U$13.MTN3 83.19,33.66 83.19,24.77 U$13.MTN1 82.87,24.45 82.23,24.45 82.23,22.54 | 77.79,33.66 U$13.MTN4 | 75.56,37.78 v75.88,38.1 | 66.04,42.23 69.85,42.23 IC2.18 | 66.04,42.23 58.42,42.23 IC2.38 58.1,42.23 55.24,42.23 | Y2.2 51.75,42.23 55.24,42.23 | 82.87,11.43 82.87,7.62 | R14.1 81.28,2.54 82.55,3.81 LED2.C 82.87,3.81 82.87,7.62 | 82.87,7.62 LED5.C | U2.2 62.87,19.05 64.77,19.05 C1.2 64.77,18.73 66.99,18.73 | 66.99,18.73 66.99,16.51 C4.2 | 66.99,18.73 67.31,18.73 C7.2 | 66.99,18.73 C7.2 | C7.2 67.31,19.05 71.12,19.05 C6.C 71.12,18.73 74.61,18.73 RESET.A2 74.93,19.05 76.52,20.64 81.28,20.64 | 82.23,22.54 82.23,21.59 | 82.23,22.54 78.74,22.54 78.42,22.23 C10.2 78.11,22.23 78.11,24.45 77.79,24.45 U$13.MTN2 77.47,24.77 77.15,25.08 71.12,25.08 C15.C 71.12,25.4 69.53,25.4 68.9,26.04 v65.72,26.04 64.45,26.04 | U1.16 63.82,26.04 64.45,26.04 | 64.45,26.04 U1.6 | v65.72,33.97 65.72,35.24 IC2.8 | v65.41,44.13 62.55,44.13 62.55,46.99 IC2.30 | 82.23,21.59 81.28,20.64 | 82.23,21.59 C12.2 | 82.87,11.43 82.87,13.02 83.5,13.02 84.14,13.65 84.14,20.64 81.28,20.64 | 82.87,11.43 LED1.C | v66.04,41.91 66.04,42.23 | v55.24,47.31 56.83,47.31 57.15,46.99 C8.2 | v55.56,31.75 57.15,31.75 C21.C
  Top 0.381: X2.1 53.66,52.39 52.39,53.66 47.31,53.66 JP5.1 40.96,47.31 28.89,47.31 JP4.2 | JP14.1 7.62,38.1 JP11.1 | JP6.11 JP10.1 | v55.24,41.91 55.24,42.23 | JP6.6 23.18,33.97 22.54,33.97 JP6.8
  Bottom 0.381: JP8.7 44.45,19.05 JP1.3 | 22.86,29.21 JP6.6 | 22.86,29.21 JP7.6 22.86,20.32 JP12.1 20.32,15.24 JP3.2 | 22.86,29.21 JP7.8 | U$2.10 75.88,47.62 75.88,43.18 76.52,42.55 | 76.52,42.55 75.88,41.91 v75.88,38.1 | 76.52,42.55 U$2.2 | v65.72,26.04 v65.72,33.97 66.04,34.29 v66.04,41.91 66.04,43.5 v65.41,44.13 | X2.1 53.98,52.07 53.98,48.58 v55.24,47.31 v55.24,41.91 55.24,32.07 v55.56,31.75 | JP9.1 4.13,13.65 4.13,23.18 JP10.1 | JP6.11 15.24,34.29 15.24,36.83 | 15.24,36.83 JP6.8 | 15.24,36.83 JP11.1 JP4.2
  pour Top: 0,55.88 85.09,55.88 85.09,0 0,0
  pour Bottom: 0,55.88 85.09,55.88 85.09,0 0,0
N$1
  Top 0.203: JPX8.1 U$4.1
N$2
  Top 0.203: LED2.A R2.1
N$3
  Top 0.203: JPX8.2 U$4.2
N$4
  Top 0.203: JPX8.3 U$4.3
N$5
  Top 0.254: 83.5,35.24 83.58,35.24
N$6
  Top 0.203: U1.12 66.36,28.89 65.41,29.84 64.45,29.84 63.5,30.8 R12.2
N$7
  Top 0.203: R13.2 66.04,29.84 66.99,28.89 U1.11
N$8
  Top 0.203: LED3.A R7.2
N$10
  Top 0.203: LED4.A 82.55,37.78 R9.2
N$11
  Top 0.203: C1.1 64.77,20.64 60.64,20.64 60.01,20 U2.4
N$12
  Top 0.203: 58.42,24.13 58.74,24.13 58.74,26.67 58.1,27.3 Q2.2 | 58.42,24.13 60.01,22.54 61.28,22.54 U1.1 | 58.42,24.13 R16.1
N$13
  Top 0.203: MPU6050.1 49.58,83.82 49.58,77.52 JPX10.1
N$14
  Top 0.203: MPU6050.2 52.12,83.82 52.12,77.52 JPX10.2
N$15
  Top 0.203: R15.1 R14.2 70.48,2.54 72.71,4.76 IC3.1
N$16
  Top 0.203: MPU6050.3 54.66,83.82 54.66,77.52 JPX10.3
N$17
  Top 0.203: MPU6050.4 57.2,83.82 57.2,77.52 JPX10.4
N$18
  Top 0.203: U$1.1 110.54,82.5 110.54,78.74 JPX1.1
N$19
  Top 0.203: MPU6050.5 59.74,83.82 59.74,77.52 JPX10.5
N$20
  Top 0.203: MPU6050.6 62.28,83.82 62.28,77.52 JPX10.6
N$21
  Top 0.203: LED5.A 77.15,7.62 R1.1
N$22
  Top 0.203: MPU6050.7 64.82,83.82 64.82,77.52 JPX10.7
N$23
  Top 0.203: LED1.A R3.1
N$24  (via drill 0.51)
  Top 0.203: v53.66,16.83 53.98,16.83 53.98,18.41 55.24,19.68 57.15,19.68 58.1,20.64 Q1.1
  Bottom 0.203: v53.66,16.83 46.99,10.16 46.99,8.57 46.04,7.62 JP1.2
N$25
  Top 0.203: U$1.2 108,82.5 108,78.74 JPX1.2
N$26
  Top 0.203: MPU6050.8 67.36,83.82 67.36,77.52 JPX10.8
N$27
  Top 0.203: JPX8.4 U$4.4
N$28
  Top 0.203: JPX8.5 U$4.5
N$29
  Top 0.203: JPX8.6 U$4.6
N$30
  Top 0.203: JPX8.7 U$4.7
N$31
  Top 0.203: JPX8.8 U$4.8
N$32
  Top 0.203: JPX8.9 U$4.9
N$33
  Top 0.203: JPX8.10 U$4.10
N$34
  Top 0.203: JPX8.11 U$4.11
N$35
  Top 0.203: JPX8.12 U$4.12
N$36
  Top 0.203: Y2.3 51.44,45.72 53.34,43.81 58.1,43.81 IC2.36
N$37
  Top 0.203: U$1.3 105.46,82.5 105.46,78.74 JPX1.3
N$38
  Top 0.203: U$1.4 102.92,82.5 102.92,78.74 JPX1.4
N$39
  Top 0.203: U$1.5 100.38,82.5 100.38,78.74 JPX1.5
N$40
  Top 0.203: Y2.1 49.21,40.64 49.21,44.13 52.39,44.13 53.66,42.86 58.1,42.86 IC2.37
N$41
  Top 0.203: U$1.6 97.84,82.5 97.84,78.74 JPX1.6
N$42
  Top 0.203: U$1.7 95.3,82.5 95.3,78.74 JPX1.7
N$43
  Top 0.203: U$1.8 92.76,82.5 92.76,78.74 JPX1.8
N$44
  Top 0.203: U$1.9 90.22,82.5 90.22,78.74 JPX1.9
N$45
  Top 0.203: U$1.10 87.68,82.5 87.68,78.74 JPX1.10
N$46
  Top 0.203: U$1.11 85.14,82.5 85.14,78.74 JPX1.11
N$47
  Top 0.203: U$1.12 82.6,82.5 82.6,78.74 JPX1.12
PISUPPLY  (via drill 0.51)
  Top 0.203: 58.42,14.92 53.98,14.92 51.75,12.7 D1.C | v69.85,10.48 71.75,10.48 72.39,9.84 IC3.3 | v62.23,14.29 61.59,14.92 58.42,14.92 | 58.42,14.92 C5.+
  Bottom 0.203: v69.85,10.48 62.23,10.48 v62.23,14.29
RX  (via drill 0.51)
  Top 0.203: v69.22,33.34 68.58,33.34 67.94,32.7 R10.1 | v67.31,43.81 69.85,43.81 IC2.20
  Bottom 0.203: v69.22,33.34 67.31,35.24 v67.31,43.81
RXD  (via drill 0.51)
  Top 0.203: v69.22,30.8 70.48,30.8 R11.2 | v67.94,22.23 67.31,21.59 63.5,21.59 63.18,21.91 U1.4
  Bottom 0.203: v69.22,30.8 67.94,29.53 v67.94,22.23
RXLED  (via drill 0.51)
  Top 0.203: U1.17 63.18,29.21 62.23,29.21 v61.91,29.53 | v83.19,44.77 83.19,43.5 82.55,43.5 LED4.C
  Bottom 0.203: v61.91,29.53 60.96,30.48 60.96,42.55 59.37,44.13 59.37,44.77 68.26,53.66 83.19,53.66 v83.19,44.77
SCL  (via drill 0.51)
  Top 0.203: v60.01,37.78 67.31,37.78 67.31,35.56 IC2.10 | v51.75,26.67 49.85,24.77 42.55,24.77 JP8.6
  Bottom 0.203: v60.01,37.78 56.52,34.29 56.52,31.43 v51.75,26.67
SDA  (via drill 0.51)
  Top 0.203: v60.01,41.27 62.55,38.73 66.99,38.73 67.94,37.78 67.94,35.56 IC2.11
  Bottom 0.203: v60.01,41.27 56.2,45.09 56.2,51.44 54.29,53.34 46.99,53.34 46.99,38.1 43.81,34.92 43.81,28.57 JP8.5
TCK  (via drill 0.51)
  Top 0.203: v76.83,39.05 76.52,39.37 73.66,39.37 71.75,37.47 70.17,37.47 IC2.12
  Bottom 0.203: v76.83,39.05 78.11,40.32 U$2.1
TDI  (via drill 0.51)
  Top 0.203: v65.09,39.69 69.85,39.69 IC2.15 | U$2.9 v76.2,49.53
  Bottom 0.203: v65.09,39.69 64.45,40.32 64.45,44.45 69.53,49.53 v76.2,49.53
TDO  (via drill 0.51)
  Top 0.203: v79.06,40.64 74.3,40.64 72.71,39.05 70.17,39.05 IC2.14
  Bottom 0.203: v79.06,40.64 79.06,42.86 U$2.3
TMS  (via drill 0.51)
  Top 0.203: v68.26,38.73 68.9,38.1 69.85,38.1 IC2.13
  Bottom 0.203: v68.26,38.73 68.58,39.05 68.58,46.67 70.48,48.58 79.06,48.58 79.06,46.04 U$2.5
TX  (via drill 0.51)
  Top 0.203: R11.1 70.48,34.29 v71.12,34.29 | v71.44,43.81 70.8,44.45 70.17,44.45 IC2.21
  Bottom 0.203: v71.12,34.29 71.44,34.61 v71.44,43.81
TXD  (via drill 0.51)
  Top 0.203: v69.22,32.07 68.9,32.07 67.94,31.11 R10.2 | v63.5,25.08 61.28,27.3 U1.20
  Bottom 0.203: v69.22,32.07 66.67,29.53 66.67,25.72 66.04,25.08 v63.5,25.08
TXLED  (via drill 0.51)
  Top 0.203: v69.53,23.18 67.31,23.18 66.99,22.86 U1.10 | v81.28,52.07 82.55,53.34 LED3.C
  Bottom 0.203: v69.53,23.18 71.75,20.95 71.75,14.61 72.71,13.65 78.11,13.65 78.11,38.42 81.28,41.59 v81.28,52.07
US1ECHO
  Bottom 0.203: JP9.4 8.26,20.95 8.26,42.55 JP14.4
US1TRIG
  Top 0.203: JP9.3 4.45,18.41 4.45,41.91 JP14.3
USBVCC  (via drill 0.51)
  Top 0.381: U1.15 64.45,26.99 69.85,26.99 | 69.85,26.99 70.17,26.99 71.12,27.94 C15.A | v71.75,23.81 74.3,23.81 F1.2 | 69.85,26.99 v69.85,26.67 | v59.37,21.59 Q1.3 | v69.85,20.32 v72.71,20.32 75.25,20.32 76.2,21.27 80.01,21.27 80.33,21.59 C12.1
  Bottom 0.381: v69.85,26.67 69.85,25.72 v71.75,23.81 72.07,23.5 72.07,21.59 72.71,20.95 v72.71,20.32 | v59.37,21.59 60.33,20.64 60.33,16.51 60.64,16.19 69.85,16.19 v69.85,20.32
VUSB  (via drill 0.51)
  Top 0.381: v73.03,22.86 75.88,22.86 76.52,22.23 C10.1 | v72.71,26.04 73.34,26.67 74.3,26.67 F1.1 74.3,26.99 76.83,26.99 77.47,27.62 U$13.VBUS
  Bottom 0.381: v73.03,22.86 72.71,23.18 v72.71,26.04

### Text on the board
tPlace: Spiked3.com | PilotV3